# EAGLE design timer (EAGLE 6.5.0)
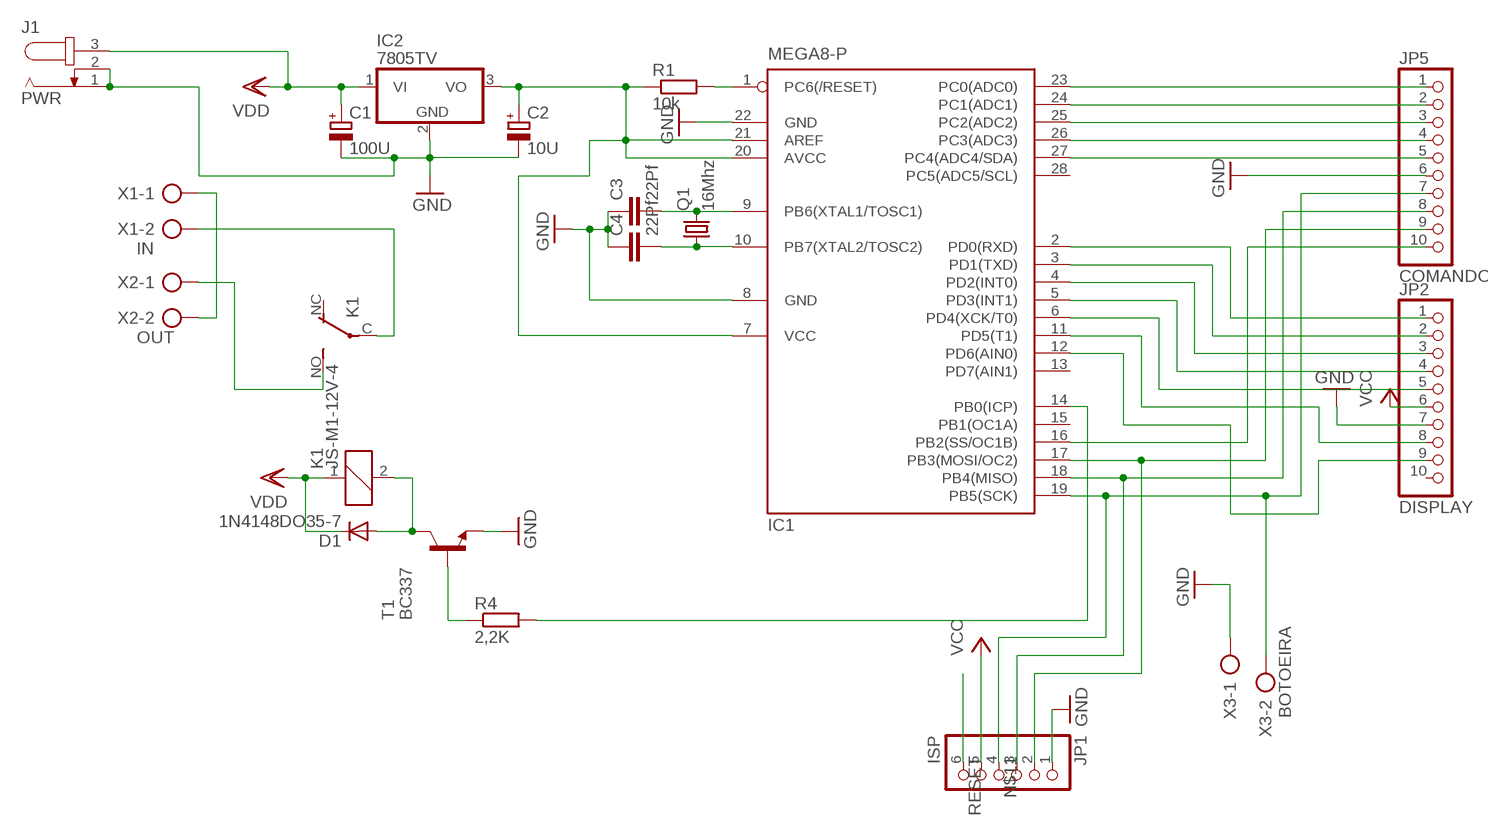
[diagram p0: schematic, sheet 1]

## Parts
C1  100U  CPOL-EUE2.5-6  [E2,5-6]
C2  10U  CPOL-EUE2.5-6  [E2,5-6]
C3  22Pf  C-EU025-025X050  [C025-025X050]
C4  22Pf  C-EU025-025X050  [C025-025X050]
D1  1N4148DO35-7  [DO35-7]
IC1  MEGA8-P  [DIL28-3]
IC2  7805TV  [TO220V]
J1  PWR  JACK-PLUG1  [SPC4078]
JP1  ISP  PINHD-1X6  [1X06]
JP2  DISPLAY  PINHD-1X10  [1X10]
JP5  COMANDO  PINHD-1X10  [1X10]
K1  JS-M1-12V-4  [JS-M]
Q1  16Mhz  CRYSTALHC49S  [HC49/S]
R1  10k  R-EU_0204/7  [0204/7]
R4  2,2K  R-EU_0204/7  [0204/7]
T1  BC337  [TO92]
X1  IN  AK500/2  [AK500/2]
X2  OUT  AK500/2  [AK500/2]
X3  BOTOEIRA  AK500/2  [AK500/2]

## Nets
GND: C1.- C2.- C3.1 C4.1 IC1.8(GND) IC1.22(GND) IC2.2(GND) J1.1 J1.2 JP1.1 JP2.7 JP5.6 T1.1(E) X3.1
N$1: X1.1 X2.2
N$2: K1.NO(2:S) X2.1
N$3: K1.C(2:P) X1.2
N$4: C3.2 IC1.9(PB6(XTAL1/TOSC1)) Q1.2
N$5: C4.2 IC1.10(PB7(XTAL2/TOSC2)) Q1.1
N$6: IC1.23(PC0(ADC0)) JP5.1
N$7: IC1.24(PC1(ADC1)) JP5.2
N$8: IC1.25(PC2(ADC2)) JP5.3
N$9: IC1.26(PC3(ADC3)) JP5.4
N$10: IC1.27(PC4(ADC4/SDA)) JP5.5
N$11: IC1.19(PB5(SCK)) JP1.4 JP5.7 X3.2
N$12: IC1.16(PB2(SS/OC1B)) JP5.10
N$13: IC1.2(PD0(RXD)) JP2.1
N$14: IC1.3(PD1(TXD)) JP2.2
N$15: IC1.4(PD2(INT0)) JP2.3
N$16: IC1.5(PD3(INT1)) JP2.4
N$17: D1.A K1.2 T1.3(C)
N$18: R4.1 T1.2(B)
N$19: IC1.14(PB0(ICP)) R4.2
N$21: IC1.18(PB4(MISO)) JP1.3 JP5.8
N$22: IC1.6(PD4(XCK/T0)) JP2.5
N$23: IC1.11(PD5(T1)) JP2.8
N$24: IC1.12(PD6(AIN0)) JP2.9
N$27: IC1.17(PB3(MOSI/OC2)) JP1.2 JP5.9
RESET: IC1.1(PC6(/RESET)) JP1.6 R1.2
VCC: C2.+ IC1.7(VCC) IC1.20(AVCC) IC1.21(AREF) IC2.3(VO) JP1.5 JP2.6 R1.1
VDD: C1.+ D1.C IC2.1(VI) J1.3 K1.1
Unconnected: IC1.13(PD7(AIN1)) IC1.15(PB1(OC1A)) IC1.28(PC5(ADC5/SCL)) JP2.10 K1.NC(2:O)

## Library data of the parts
C1 C2 = rcl:CPOL-EU: POLARIZED CAPACITOR, European symbol
C3 C4 = rcl:C-EU: CAPACITOR, European symbol
D1 = diode:1N4148: DIODE high speed (Philips)
IC1 = atmel:MEGA8-P: MICROCONTROLLER 8 Kbytes FLASH, 1 kbytes SRAM, 512 bytes EEPROM, USART, 4-channel 10 bit ADC, 2-channel 8 bit ADC Pin compatible with Atmega48, ATMega88, ATMega168 Source: avr.lbr; OC_FARNELL: unknown; OC_NEWARK: unknown
IC2 = linear:78*: Positive VOLTAGE REGULATOR Source: http://cache.national.com/ds/LM/LM78L05.pdf http://www.fairchildsemi.com/ds/LM/LM7805.pdf
J1 = con-jack:JACK-PLUG: DC POWER JACK Power Jack, DC, Right Angle, Through Hole, Rated 5A at 16VDC, PC Terminals Distributor: Farnell (www.Farnell.de) Drawing: 84N1161.pdf / 84N1162.pdf Manufacturer: SPC Technology (www.spctechnology.com) Type: SPC4077 / SPC 4078; OC_FARNELL: unknown; OC_NEWARK: unknown
JP1 = pinhead:PINHD-1X6: PIN HEADER
JP2 JP5 = pinhead:PINHD-1X10: PIN HEADER
K1 = relay:JS-M1*: Automotive Ultra-Miniature Power Relay NAiS Source: http://www.mew-europe.com/.. en_ds_61211_0000.pdf; MPN: JSM1-12V-4; OC_FARNELL: 910338; OC_NEWARK: 13P4552
Q1 = crystal:CRYSTAL: CRYSTAL; OC_FARNELL: 1667008; OC_NEWARK: unknown
R1 R4 = rcl:R-EU_: RESISTOR, European symbol
T1 = transistor:BC337: NPN TRANSISTOR
X1-X3 = con-ptr500:AK500/2: CONNECTOR; OC_FARNELL: unknown; OC_NEWARK: unknown

## Board
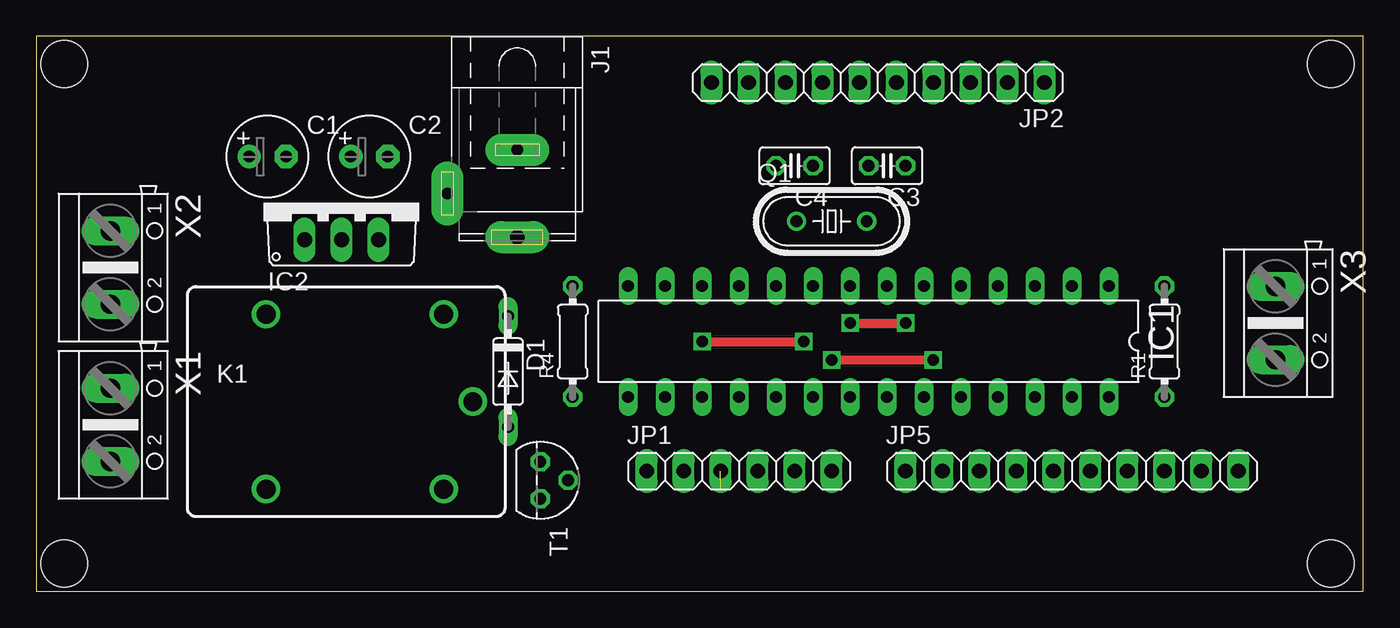
[diagram p1: board, top side]
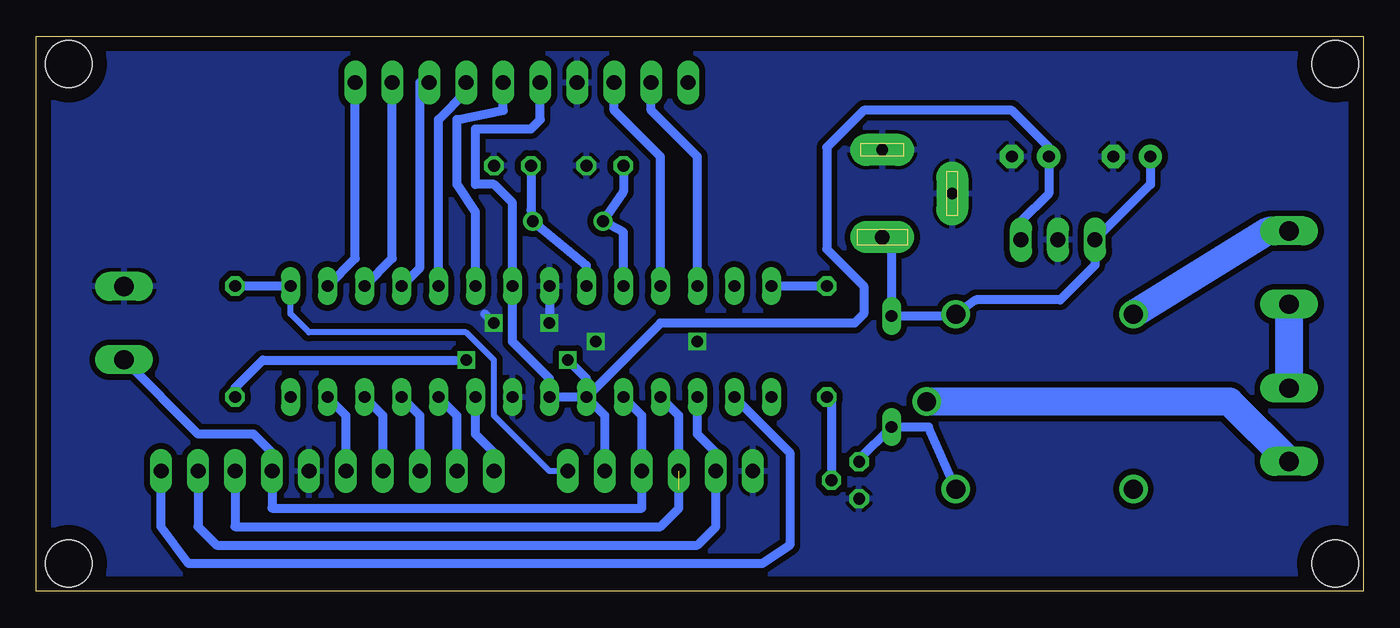
[diagram p2: board, bottom side, seen from below]

Size 91.11 x 38.09 mm. Coordinates in mm from the lower left corner, seen from the top.
Outline: 0,0 91.11,0 91.11,38.09 0,38.09 0,0
Copper layers (1*16): Top 0.035mm / dielectric 1.5mm / Bottom 0.035mm
Design rules "default": minimum track width 10mil, minimum drill 24mil, track to track 8mil, track to pad 8mil, pad to pad 8mil, via to via 8mil, smd to smd 8mil, copper to edge 40mil, drill to drill 8mil, minimum pad ring 10mil, minimum via ring 8mil, stop-mask expansion 4mil, vias tented up to drill 0mil, thermal gap 10mil
Holes 3.2 mm at 1.91,36.2 1.91,1.91 88.9,1.91 88.9,36.2

### Footprints (pad centres in the part's own frame; a part is rotated, then mirrored left to right if it is on the bottom)
E2,5-6 = drill 0.813 pad 1.6: + -1.27,0 | drill 0.813 pad 1.6 octagon: - 1.27,0
C025-025X050 = drill 0.813 octagon: 1 -1.27,0; 2 1.27,0
DO35-7 = drill 0.813 long: A 3.81,0; C -3.81,0
DIL28-3 = drill 0.813 long: 1 -16.51,-3.81; 2 -13.97,-3.81; 3 -11.43,-3.81; 4 -8.89,-3.81; 5 -6.35,-3.81; 6 -3.81,-3.81; 7 -1.27,-3.81; 8 1.27,-3.81; 9 3.81,-3.81; 10 6.35,-3.81; 11 8.89,-3.81; 12 11.43,-3.81; 13 13.97,-3.81; 14 16.51,-3.81; 15 16.51,3.81; 16 13.97,3.81; 17 11.43,3.81; 18 8.89,3.81; 19 6.35,3.81; 20 3.81,3.81; 21 1.27,3.81; 22 -1.27,3.81; 23 -3.81,3.81; 24 -6.35,3.81; 25 -8.89,3.81; 26 -11.43,3.81; 27 -13.97,3.81; 28 -16.51,3.81
TO220V = drill 1.016 long: 1 -2.54,-2.54; 2 0,-2.54; 3 2.54,-2.54
SPC4078 = drill 0.8 pad 2.184 long: 1 -3,0; 2 0,-4.8 | drill 1 pad 2.184 long: 3 3,0
1X06 = drill 1.016 long: 1 -6.35,0; 2 -3.81,0; 3 -1.27,0; 4 1.27,0; 5 3.81,0; 6 6.35,0
1X10 = drill 1.016 long: 1 -11.43,0; 2 -8.89,0; 3 -6.35,0; 4 -3.81,0; 5 -1.27,0; 6 1.27,0; 7 3.81,0; 8 6.35,0; 9 8.89,0; 10 11.43,0
JS-M = drill 1.3: 1 6.7,6; 2 6.7,-6; C 8.7,0; NC -5.5,-6; NO -5.5,6
HC49/S = drill 0.813: 1 -2.413,0; 2 2.413,0
0204/7 = drill 0.813 octagon: 1 -3.81,0; 2 3.81,0
TO92 = drill 0.813 octagon: 1 1.27,0; 2 0,1.905; 3 -1.27,0
AK500/2 = drill 1.321 long: 1 -2.515,0; 2 2.515,0

### Placement (x,y rotation side)
C1  15.88,29.84 0 top
C2  22.86,29.84 0 top
C3  58.42,29.21 180 top
C4  52.07,29.21 180 top
D1  32.38,15.08 270 top
IC1  57.15,17.14 180 top
IC2  20.95,26.67 0 top
J1  33.02,27.3 270 top
JP1  48.26,8.26 0 top
JP2  57.78,34.92 180 top
JP5  71.12,8.26 0 top
K1  21.27,13.02 0 top
Q1  54.61,25.4 0 top
R1  77.47,17.14 90 top
R4  36.83,17.14 90 top
T1  34.61,7.62 270 top
X1  5.08,11.43 270 top
X2  5.08,22.23 270 top
X3  85.09,18.41 270 top

### Tracks (layer width: path | path; a pad name or v marks a point on that pad's centre or on a via)
GND  (via drill 0.8)
  Top 0.61: v55.88,18.41 v59.69,18.41 | v45.72,17.14 v52.7,17.14
  Bottom 0.61: IC1.8 v55.88,18.41 | v59.69,18.41 60.33,19.05
  pour Bottom (isolate 0.406): 0,38.1 0,0 91.44,0 91.44,3.81 91.44,38.1
N$1
  Bottom 1.93: X1.1 X2.2
N$2
  Bottom 1.93: X2.1 6.5,24.74 K1.NO
N$3
  Bottom 1.93: X1.2 9.18,13.02 K1.C
N$4
  Bottom 0.61: IC1.9 53.34,22.35 Q1.2 57.15,26.16 C3.2
N$5
  Bottom 0.61: IC1.10 50.8,24.64 Q1.1 50.8,27.43 C4.2
N$6
  Bottom 0.61: JP5.1 59.69,9.53 60.96,10.79 IC1.23
N$7
  Bottom 0.61: JP5.2 62.23,12.06 IC1.24
N$8
  Bottom 0.61: JP5.3 64.77,12.06 IC1.25
N$9
  Bottom 0.61: JP5.4 67.31,12.06 IC1.26
N$10
  Bottom 0.61: JP5.5 69.85,12.06 IC1.27
N$11
  Bottom 0.61: IC1.19 49.53,12.06 JP1.4 49.53,5.71 74.93,5.71 JP5.7 74.93,9.53 76.2,10.79 79.98,10.79 X3.2
N$12
  Bottom 0.61: IC1.16 39.37,9.53 39.37,3.17 41.27,1.91 80.64,1.91 82.55,4.45 JP5.10
N$13
  Bottom 0.61: IC1.2 69.22,22.86 JP2.1
N$14
  Bottom 0.61: IC1.3 66.67,22.86 JP2.2
N$15
  Bottom 0.61: IC1.4 64.77,22.23 64.77,34.92 JP2.3
N$16
  Bottom 0.61: IC1.5 63.5,32.38 61.59,34.29 JP2.4
N$17
  Bottom 0.61: K1.2 29.84,11.27 D1.A 34.61,9.05 T1.3
N$18
  Bottom 0.61: R4.1 36.51,13.34 T1.2
N$19
  Bottom 0.61: R4.2 IC1.14
N$21  (1 unrouted)
  Bottom 0.61: JP1.3 46.99,12.06 IC1.18 | JP5.8 77.47,4.45 48.26,4.45 46.99,5.71 46.99,6.99
N$22
  Bottom 0.61: IC1.6 60.96,26.04 62.23,27.94 62.23,32.38 59.05,33.02 JP2.5
N$23
  Bottom 0.61: IC1.11 48.26,29.84 51.44,33.02 JP2.8
N$24
  Bottom 0.61: IC1.12 45.72,29.84 48.9,33.02 JP2.9
N$27
  Bottom 0.61: JP5.9 80.01,4.45 78.74,3.17 45.72,3.17 44.45,4.45 JP1.2 44.45,9.53 45.72,10.79 IC1.17
RESET
  Bottom 0.406: JP1.6 55.88,8.26 59.69,12.06 59.69,15.88 61.59,17.78 72.39,17.78 73.66,19.05 IC1.1
  Bottom 0.61: IC1.1 R1.2
VCC  (via drill 0.8)
  Top 0.61: v61.59,15.88 v54.61,15.88
  Bottom 0.61: JP1.5 52.07,12.06 IC1.20 | IC1.20 IC1.21 55.88,14.61 58.42,17.14 IC1.7 | 58.42,20.32 IC1.7 | IC1.7 58.42,26.67 59.69,27.94 60.96,27.94 60.96,31.75 57.15,31.75 56.52,32.38 JP2.6 | R1.1 77.47,13.97 75.56,15.88 v61.59,15.88 | v54.61,15.88 53.34,14.61 IC1.20 | 23.5,23.5 IC2.3 23.5,25.4 21.59,27.3 C2.+ 21.59,30.48 24.13,33.02 34.29,33.02 36.83,30.48 36.83,23.5 34.29,20.95 34.29,19.05 34.92,18.41 48.26,18.41 IC1.20
VDD
  Bottom 0.61: C1.+ 14.61,27.94 IC2.1 18.41,22.38 20.8,20 26.58,20 K1.1 28.26,18.89 D1.C 32.38,23.67 J1.3